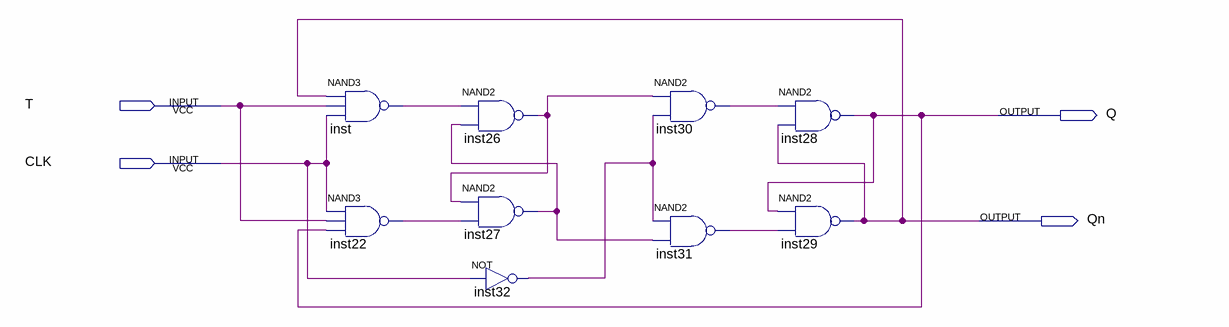
[diagram p0: schematic sheet]
// Quartus schematic msjkff.bdf as structural Verilog: 9 symbols, 4 pins
module msjkff (
  input  T,
  input  CLK,
  output Q,
  output Qn
);

  wire inst22_out, inst26_out, inst27_out, inst30_out, inst31_out, inst32_out, inst_out;

  nand inst (inst_out, Qn, T, CLK);
  nand inst22 (inst22_out, CLK, T, Q);
  nand inst26 (inst26_out, inst_out, inst27_out);
  nand inst27 (inst27_out, inst26_out, inst22_out);
  not inst32 (inst32_out, CLK);
  nand inst30 (inst30_out, inst26_out, inst32_out);
  nand inst31 (inst31_out, inst32_out, inst27_out);
  nand inst28 (Q, inst30_out, Qn);
  nand inst29 (Qn, Q, inst31_out);
endmodule
